# EAGLE design SaL_GPSTrack (EAGLE 8.3.1)
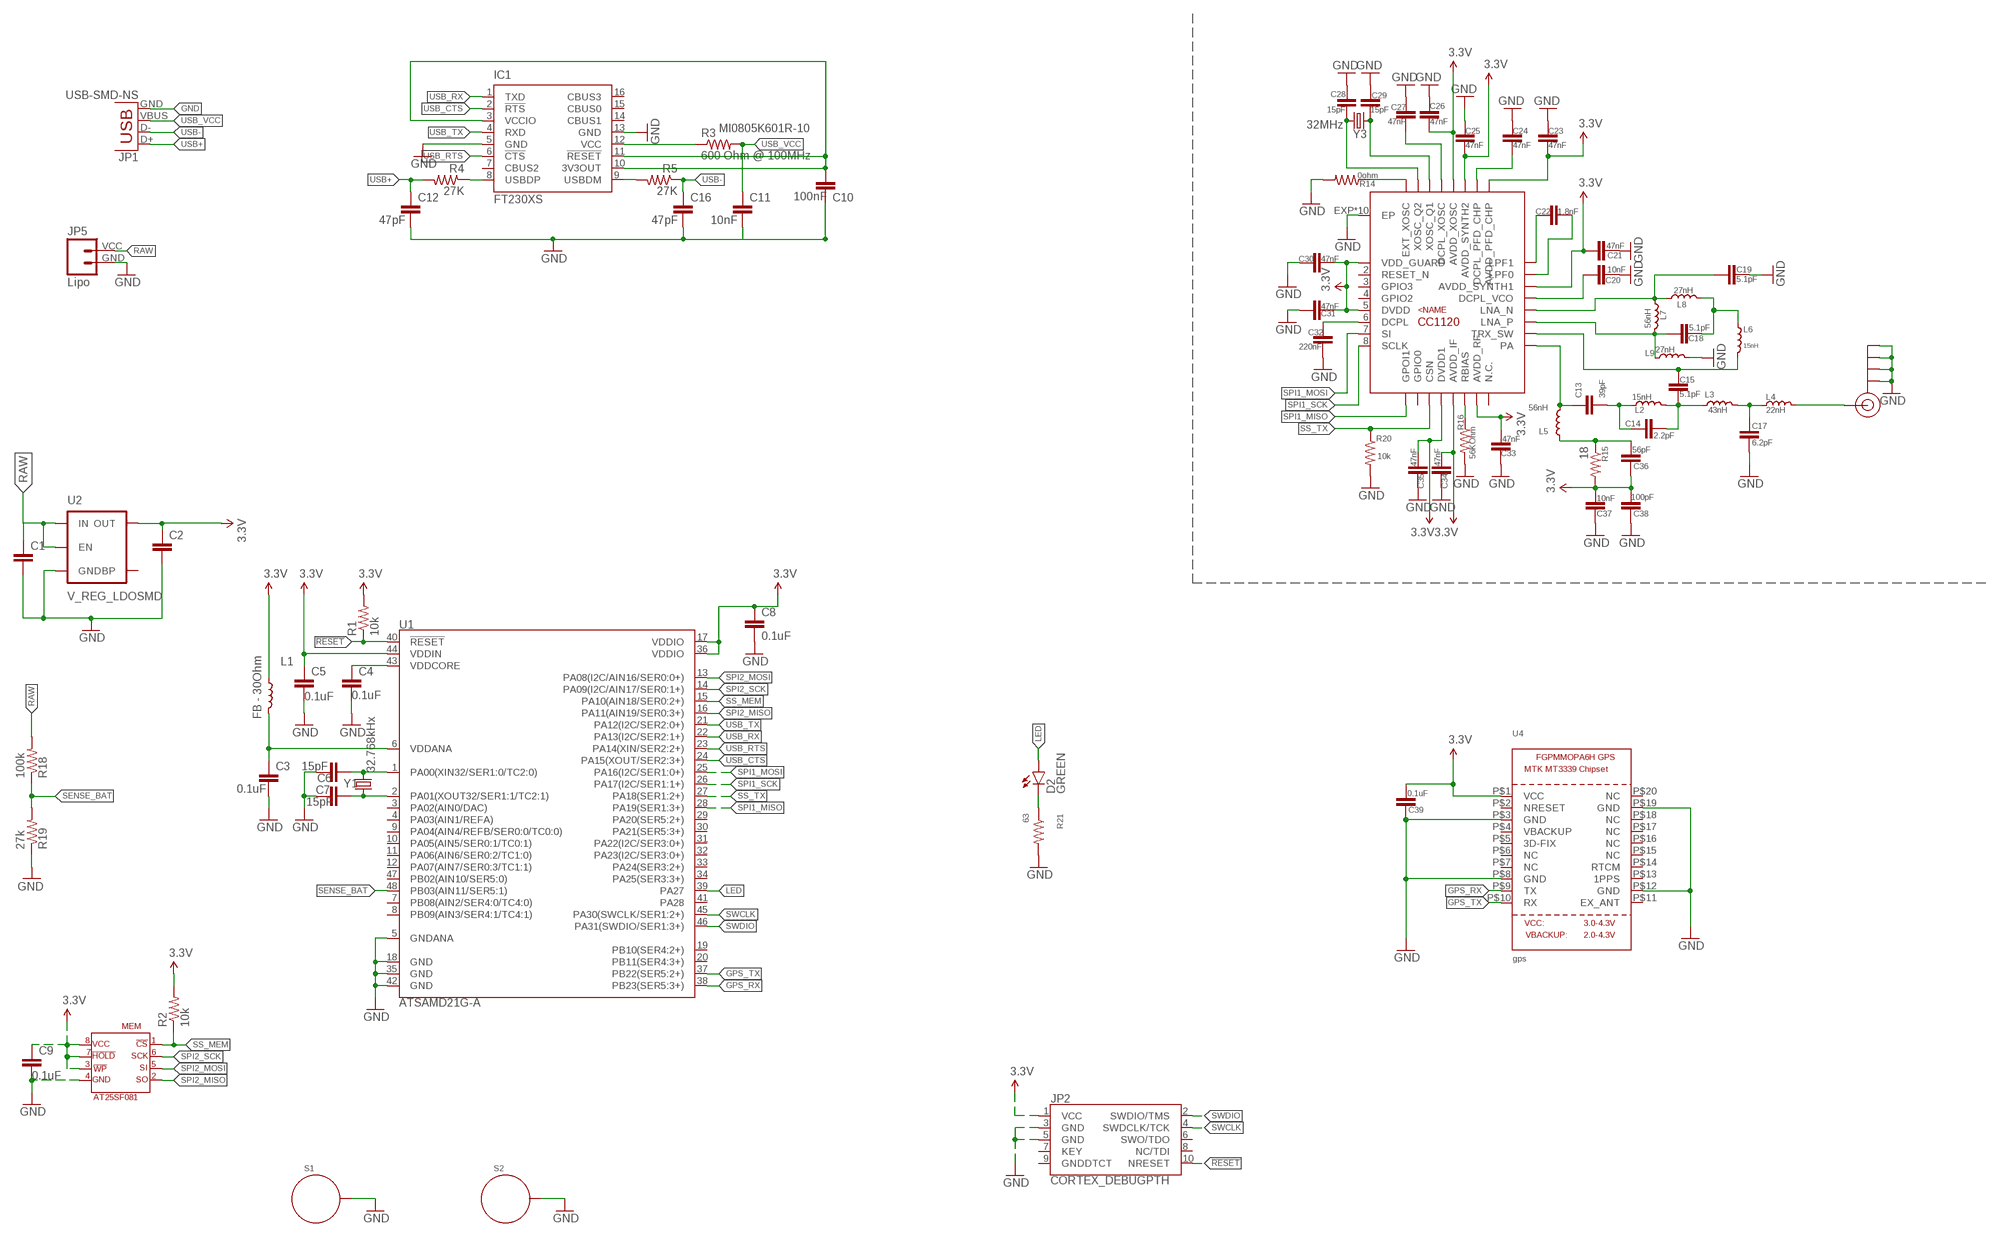
[diagram p0: schematic, sheet 1]

## Parts
C1  CAP0603-CAP  [0603-CAP]
C2  CAP0603-CAP  [0603-CAP]
C3  0.1uF  CAP0402-CAP  [0402-CAP]
C4  0.1uF  CAP0402-CAP  [0402-CAP]
C5  0.1uF  CAP0402-CAP  [0402-CAP]
C6  15pF  CAP0402-CAP  [0402-CAP]
C7  15pF  CAP0402-CAP  [0402-CAP]
C8  0.1uF  CAP0402-CAP  [0402-CAP]
C9  0.1uF  CAP0402-CAP  [0402-CAP]
C10  100nF  CAP0402-CAP  [0402-CAP]
C11  10nF  CAP0402-CAP  [0402-CAP]
C12  47pF  CAP0402-CAP  [0402-CAP]
C13  39pF  CAP0402-CAP  [0402-CAP]
C14  2.2pF  CAP0402-CAP  [0402-CAP]
C15  5.1pF  CAP0402-CAP  [0402-CAP]
C16  47pF  CAP0402-CAP  [0402-CAP]
C17  6.2pF  CAP0402-CAP  [0402-CAP]
C18  5.1pF  CAP0402-CAP  [0402-CAP]
C19  5.1pF  CAP0402-CAP  [0402-CAP]
C20  10nF  CAP0402-CAP  [0402-CAP]
C21  47nF  CAP0402-CAP  [0402-CAP]
C22  1.8nF  CAP0402-CAP  [0402-CAP]
C23  47nF  CAP0402-CAP  [0402-CAP]
C24  47nF  CAP0402-CAP  [0402-CAP]
C25  47nF  CAP0402-CAP  [0402-CAP]
C26  47nF  CAP0402-CAP  [0402-CAP]
C27  47nF  CAP0402-CAP  [0402-CAP]
C28  15pF  CAP0402-CAP  [0402-CAP]
C29  15pF  CAP0402-CAP  [0402-CAP]
C30  47nF  CAP0402-CAP  [0402-CAP]
C31  47nF  CAP0402-CAP  [0402-CAP]
C32  220nF  CAP0402-CAP  [0402-CAP]
C33  47nF  CAP0402-CAP  [0402-CAP]
C34  47nF  CAP0402-CAP  [0402-CAP]
C35  47nF  CAP0402-CAP  [0402-CAP]
C36  56pF  CAP0402-CAP  [0402-CAP]
C37  10nF  CAP0402-CAP  [0402-CAP]
C38  100pF  CAP0402-CAP  [0402-CAP]
C39  0.1uF  CAP0402-CAP  [0402-CAP]
D2  GREEN  LED-GREEN1206  [LED-1206]
IC1  FT230XS  [SSOP16]
J$1  SMA_EDGE  [SMA-EDGE]
JP1  USB-SMD-NS  [USB-MINIB-NOSTOP]
JP2  CORTEX_DEBUGPTH  [2X5-PTH-1.27MM]
JP5  Lipo  M024UCON-15767  [JST-2-SMD-VERT]
L1  FB - 30Ohm  INDUCTOR0603  [0603]
L2  15nH  INDUCTOR0402  [C0402]
L3  43nH  INDUCTOR0402  [C0402]
L4  22nH  INDUCTOR0402  [C0402]
L5  56nH  INDUCTOR0402  [C0402]
L6  15nH  INDUCTOR0402  [C0402]
L7  56nH  INDUCTOR0402  [C0402]
L8  27nH  INDUCTOR0402  [C0402]
L9  27nH  INDUCTOR0402  [C0402]
MEM  AT25SF081  [AT25SF081]
R1  10k  RESISTOR0402-RES  [0402-RES]
R2  10k  RESISTOR0402-RES  [0402-RES]
R3  600 Ohm @ 100MHz  RESISTOR0603-RES  [0603-RES]
R4  27K  RESISTOR0402-RES  [0402-RES]
R5  27K  RESISTOR0402-RES  [0402-RES]
R14  0ohm  RESISTOR0402-RES  [0402-RES]
R15  18  RESISTOR0402-RES  [0402-RES]
R16  56KOhm  RESISTOR0402-RES  [0402-RES]
R18  100k  RESISTOR0402-RES  [0402-RES]
R19  27k  RESISTOR0402-RES  [0402-RES]
R20  10k  RESISTOR0402-RES  [0402-RES]
R21  63  RESISTOR0402  [0402-RES]
S1  STANDOFF_ELECTRICAL  [STANDOFF-ELECTRICAL]
S2  STANDOFF_ELECTRICAL  [STANDOFF-ELECTRICAL]
TX/RX  CC1120  [CC1120]
U1  ATSAMD21G-A  [TQFP-48]
U2  V_REG_LDOSMD  [SOT23-5]
U4  gps  GPS_FGPMMOPA6H  [FGPMMOPA6H]
Y1  32.768kHx  CRYSTAL3.2X1.5MM  [CRYSTAL-SMD-3.2X1.5MM]
Y3  32MHz  CRYSTAL5X3  [CRYSTAL-SMD-5X3]

## Nets
!RESET: JP2.10(NRESET) R1.1 U1.40(!RESET!)
+3.3V: C2.1 C5.1 C8.1 C9.1 C21.1 C23.2 C25.2 C26.2 C30.2 C31.2 C33.2 C34.2 C35.2 C36.1 C37.2 C38.2 C39.2 JP2.1(VCC) L1.1 MEM.!HOLD MEM.!WP MEM.VCC R1.2 R2.2 R15.2 TX/RX.1(VDD_GUARD) TX/RX.5(DVDD) TX/RX.12(DVDD1) TX/RX.13(AVDD_IF) TX/RX.15(AVDD_RF) TX/RX.22(AVDD_SYNTH1) TX/RX.25(AVDD_PFD_CHP) TX/RX.27(AVDD_SYNTH2) TX/RX.28(AVDD_XOSC) U1.17(VDDIO) U1.36(VDDIO) U1.44(VDDIN) U2.5(OUT) U4.P$1(VCC) ; supply symbol labelled 3.3V
GND: C1.2 C2.2 C3.2 C4.2 C5.2 C6.2 C7.2 C8.2 C9.2 C10.2 C11.2 C12.2 C16.2 C17.2 C19.2 C20.2 C21.2 C23.1 C24.1 C25.1 C26.1 C27.1 C28.1 C29.1 C30.1 C31.1 C32.1 C33.1 C34.1 C35.1 C37.1 C38.1 C39.1 IC1.5(GND) IC1.13(GND) J$1.GND@0(GND) J$1.GND@1(GND) J$1.GND@2(GND) J$1.GND@3(GND) JP1.GND JP2.3(GND) JP2.5(GND) JP5.GND L9.2 MEM.GND R14.2 R16.2 R19.1 R20.2 R21.2 S1.P1 S2.P1 TX/RX.EXP(EP) TX/RX.EXP@1(EP) TX/RX.EXP@2(EP) TX/RX.EXP@3(EP) TX/RX.EXP@4(EP) TX/RX.EXP@5(EP) TX/RX.EXP@6(EP) TX/RX.EXP@7(EP) TX/RX.EXP@8(EP) TX/RX.EXP@9(EP) U1.5(GNDANA) U1.18(GND) U1.35(GND) U1.42(GND) U2.2(GND) U4.P$3(GND) U4.P$8(GND) U4.P$12(GND) U4.P$19(GND)
GPS_RX: U1.38(PB23(SER5:3+)) U4.P$9(TX)
GPS_TX: U1.37(PB22(SER5:2+)) U4.P$10(RX)
LED: D2.A U1.39(PA27)
N$1: IC1.12(VCC) R3.1
N$3: C6.1 U1.1(PA00(XIN32/SER1:0/TC2:0)) Y1.P$2
N$4: C7.1 U1.2(PA01(XOUT32/SER1:1/TC2:1)) Y1.P$1
N$5: C3.1 L1.2 U1.6(VDDANA)
N$6: C4.1 U1.43(VDDCORE)
N$7: C10.1 IC1.3(VCCIO) IC1.10(3V3OUT) IC1.11(!RESET)
N$8: IC1.8(USBDP) R4.1
N$9: C13.1 L5.2 TX/RX.17(PA)
N$10: C13.2 C14.1 L2.1
N$11: C14.2 C15.1 L2.2 L3.1
N$12: C17.1 L3.2 L4.1
N$13: J$1.SIG(SIGNAL) L4.2
N$14: IC1.9(USBDM) R5.2
N$16: C15.2 L6.2 TX/RX.18(TRX_SW)
N$17: C18.1 L7.2 L9.1 TX/RX.19(LNA_P)
N$18: C18.2 L6.1 L8.2
N$19: C19.1 L7.1 L8.1 TX/RX.20(LNA_N)
N$20: C22.1 TX/RX.24(LPF1)
N$21: C22.2 TX/RX.23(LPF0)
N$22: C20.1 TX/RX.21(DCPL_VCO)
N$23: C24.2 TX/RX.26(DCPL_PFD_CHP)
N$24: R16.1 TX/RX.14(RBIAS)
N$25: R14.1 TX/RX.32(EXT_XOSC)
N$26: C27.2 TX/RX.29(DCPL_XOSC)
N$27: C29.2 TX/RX.30(XOSC_Q1) Y3.3
N$28: C28.2 TX/RX.31(XOSC_Q2) Y3.1
N$29: D2.C R21.1
N$34: C32.2 TX/RX.6(DCPL)
N$38: C36.2 L5.1 R15.1
RAW: C1.1 JP5.VCC R18.2 U2.1(IN) U2.3(EN)
SENSE_BAT: R18.1 R19.2 U1.48(PB03(AIN11/SER5:1))
SPI1_MISO: TX/RX.9(GPOI1) U1.28(PA19(SER1:3+))
SPI1_MOSI: TX/RX.7(SI) U1.25(PA16(I2C/SER1:0+))
SPI1_SCK: TX/RX.8(SCLK) U1.26(PA17(I2C/SER1:1+))
SPI2_MISO: MEM.SO U1.16(PA11(AIN19/SER0:3+))
SPI2_MOSI: MEM.SI U1.13(PA08(I2C/AIN16/SER0:0+))
SPI2_SCK: MEM.SCK U1.14(PA09(I2C/AIN17/SER0:1+))
SS_MEM: MEM.!CS R2.1 U1.15(PA10(AIN18/SER0:2+))
SS_TX: R20.1 TX/RX.11(CSN) U1.27(PA18(SER1:2+))
SWCLK: JP2.4(SWDCLK/TCK) U1.45(PA30(SWCLK/SER1:2+))
SWDIO: JP2.2(SWDIO/TMS) U1.46(PA31(SWDIO/SER1:3+))
USB+: C12.1 JP1.D+ R4.2
USB-: C16.1 JP1.D- R5.1
USB_CTS: IC1.2(!RTS) U1.24(PA15(XOUT/SER2:3+))
USB_RTS: IC1.6(!CTS) U1.23(PA14(XIN/SER2:2+))
USB_RX: IC1.1(TXD) U1.22(PA13(I2C/SER2:1+))
USB_TX: IC1.4(RXD) U1.21(PA12(I2C/SER2:0+))
USB_VCC: C11.1 JP1.VBUS R3.2
Unconnected: IC1.7(CBUS2) IC1.14(CBUS1) IC1.15(CBUS0) IC1.16(CBUS3) JP2.6(SWO/TDO) JP2.7(KEY) JP2.8(NC/TDI) JP2.9(GNDDTCT) TX/RX.2(RESET_N) TX/RX.3(GPIO3) TX/RX.4(GPIO2) TX/RX.10(GPIO0) TX/RX.16(N.C.) U1.3(PA02(AIN0/DAC)) U1.4(PA03(AIN1/REFA)) U1.7(PB08(AIN2/SER4:0/TC4:0)) U1.8(PB09(AIN3/SER4:1/TC4:1)) U1.9(PA04(AIN4/REFB/SER0:0/TC0:0)) U1.10(PA05(AIN5/SER0:1/TC0:1)) U1.11(PA06(AIN6/SER0:2/TC1:0)) U1.12(PA07(AIN7/SER0:3/TC1:1)) U1.19(PB10(SER4:2+)) U1.20(PB11(SER4:3+)) U1.29(PA20(SER5:2+)) U1.30(PA21(SER5:3+)) U1.31(PA22(I2C/SER3:0+)) U1.32(PA23(I2C/SER3:0+)) U1.33(PA24(SER3:2+)) U1.34(PA25(SER3:3+)) U1.41(PA28) U1.47(PB02(AIN10/SER5:0)) U2.4(BP) U4.P$2(NRESET) U4.P$4(VBACKUP) U4.P$5(3D-FIX) U4.P$6(NC) U4.P$7(NC) U4.P$11(EX_ANT) U4.P$13(1PPS) U4.P$14(RTCM) U4.P$15(NC) U4.P$16(NC) U4.P$17(NC) U4.P$18(NC) U4.P$20(NC)

## Library data of the parts
C1 C2 C13-C15 C17-C39 = SparkFun-Capacitors:CAP: Capacitor Standard 0603 ceramic capacitor, and 0.1" leaded capacitor.
C3-C12 C16 = SparkFun-Passives:CAP: Capacitor Standard 0603 ceramic capacitor, and 0.1" leaded capacitor.
D2 = SparkFun-LED:LED-GREEN: Various green LEDs Green LEDs used in SFE Production 0603- DIO-00821 LARGE- DIO-00862 LILYPAD- DIO-09910; PROD_ID: DIO-00862
IC1 = ftdichip:FT230X: USB to BASIC UART IC Auto generated by make-symbol-device-package-bsdl.ulp Rev. 43 Source: Data sheet <http://www.ftdichip.com/Support/Documents/DataSheets/ICs/DS_FT230X.pdf>
J$1 = SparkFun-Connectors:SMA_EDGE: SMA Antenna Connector End launch SMA connector. The paste layer has been removed so that the connector can be hand soldered onto the board after reflow.
JP1 = SparkFun-Connectors:USB: USB Connectors USB-B-PTH is fully proven SKU : PRT-00139/CONN-08278 USB-miniB is fully proven SKU : PRT-00587 USB-A-PCB is untested. USB-A-H is throughly reviewed, but untested. Spark Fun Electronics SKU : PRT-00437 USB-B-SMT is throughly reviewed, but untested. Needs silkscreen touching up. USB-A-S has not been used/tested USB-MB-H has not been used/tested USB-MICROB has been used. CONN-09505
JP2 = SparkFun-Connectors:CORTEX_DEBUG: Cortex Debug Connector Datasheet <http://infocenter.arm.com/help/topic/com.arm.doc.faqs/attached/13634/cortex_debug_connectors.pdf>
JP5 = SparkFun-Connectors:M02: Standard 2-pin 0.1" header. Use with - straight break away headers ( PRT-00116) - right angle break away headers (PRT-00553) - swiss pins (PRT-00743) - machine pins (PRT-00117) - female headers (PRT-00115) Molex polarized connector foot print use with: PRT-08233 with associated crimp pins and housings. 2.54_SCREWTERM for use with PRT-10571. 3.5mm Screw Terminal footprints for PRT-08084 5mm Screw Terminal footprints for use with PRT-08432
L1-L9 = SparkFun-Passives:INDUCTOR: Inductors Basic Inductor/Choke - 0603 and 1206. Footprints are not proven and vary greatly between part numbers. INDUCTOR POWER 3.3UH 4.0A SMD 0.197" L x 0.197" W x 0.177" H (5.00mm x 5.00mm x 4.50mm)
MEM = SaL-lib:AT25SF081: AT25SF081 - 8M memory smd
R1 R2 R4 R5 R14-R16 R18-R20 = SparkFun-Passives:RESISTOR: Resistor Basic schematic elements and footprints for 0603, 1206, and PTH resistors.
R3 = SparkFun-Resistors:RESISTOR: Resistor Basic schematic elements and footprints for 0603, 1206, and PTH resistors.; MI0805K601R-10: MI0805K601R-10
R21 = SparkFun-Resistors:RESISTOR: Resistor Basic schematic elements and footprints for 0603, 1206, and PTH resistors.
S1 S2 = SparkFun-Electromechanical:STANDOFF_ELECTRICAL: A standoff intended to be an electrically connected point. Pad size and stop size allow for a #4 Phillips pan screw head to make a solid connection to the board.
TX/RX = SaL-lib:CC1120
U1 = SparkFun-DigitalIC:ATSAMD21G: Atmel SAMD21G SMART ARM-Based Microcontroller The Atmel ® | SMART ™ SAM D21 is a series of low-power microcontrollers using the 32-bit ARM ® Cortex ® -M0+ processor, and ranging from 32- to 64-pins with up to 256KB Flash and 32KB of SRAM. The SAM D21 devices operate at a maximum frequency of 48MHz and reach 2.46 CoreMark/MHz. They are designed for simple and intuitive migration with identical peripheral modules, hex compatible code, identical linear address map and pin compatible migration paths between all devices in the product series. All devices include intelligent and flexible peripherals, Atmel Event System for inter-peripheral signaling, and support for capacitive touch button, slider and wheel user interfaces.; PROD_ID: IC-13064
U2 = SparkFun-PowerIC:V_REG_LDO: Voltage Regulator LDO Standard 150mA LDO voltage regulator in SOT-23 layout. Micrel part MIC5205. BP (by-pass) pin is used to lower output noise with 470pF cap.
U4 = adafruit:GPS_FGPMMOPA6H: GPS Module - MTK MT3339 Chipset, -165dBm sensitivity, 22 channels, 10Hz, auto-select external antenna options
Y1 = SparkFun-FreqCtrl:CRYSTAL: Various standard crystals. Proven footprints.
Y3 = SparkFun-FreqCtrl:CRYSTAL: Various standard crystals. Proven footprints.; PROD_ID: XTAL-08218

## Board
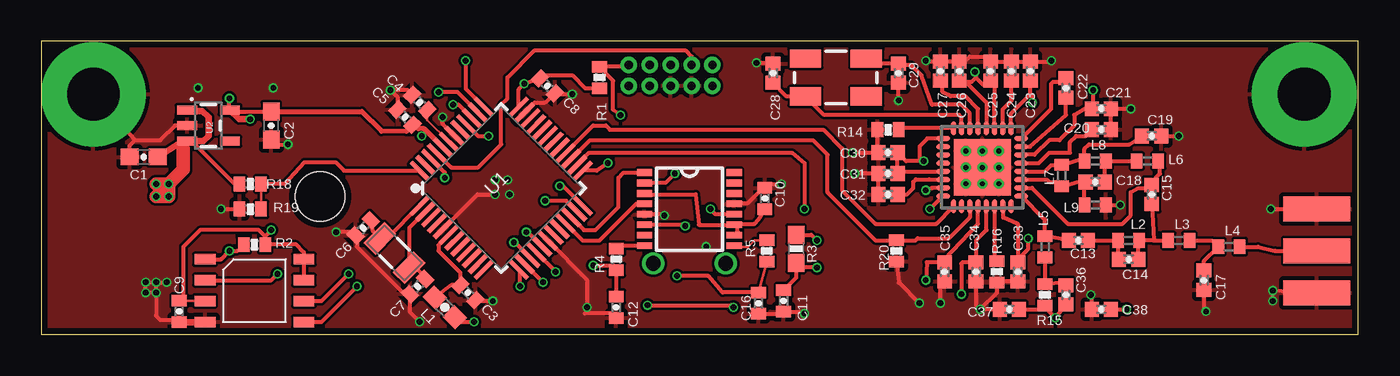
[diagram p1: board, top side]
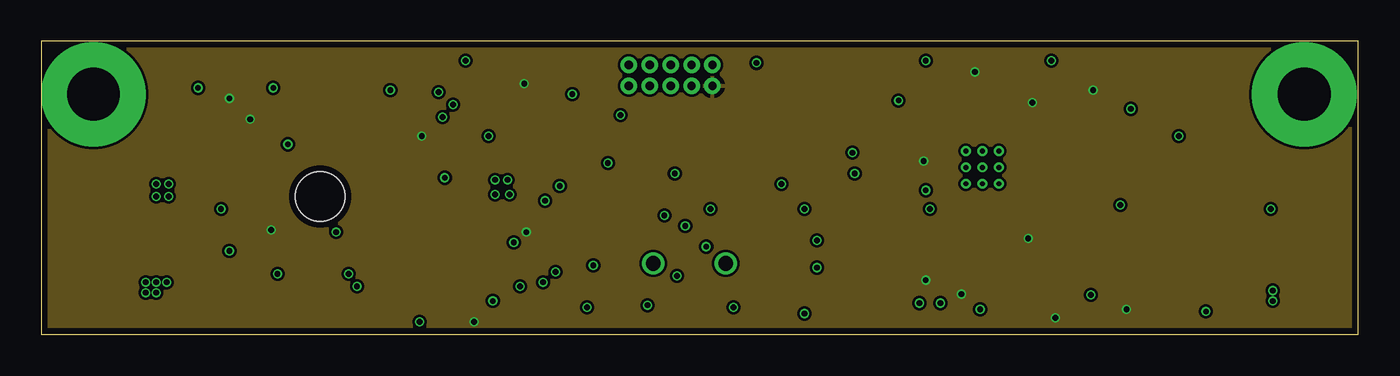
[diagram p2: board, inner layer Route2]
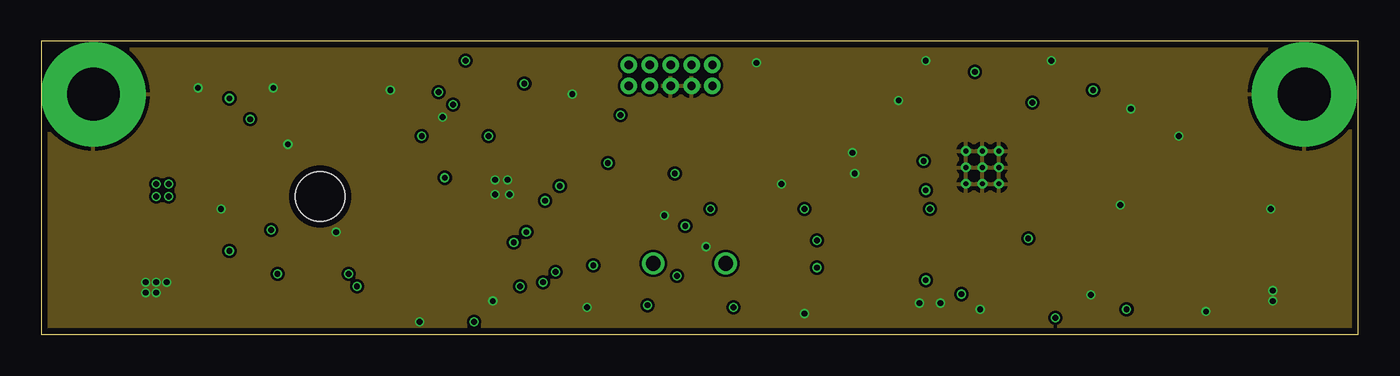
[diagram p3: board, inner layer Route15]
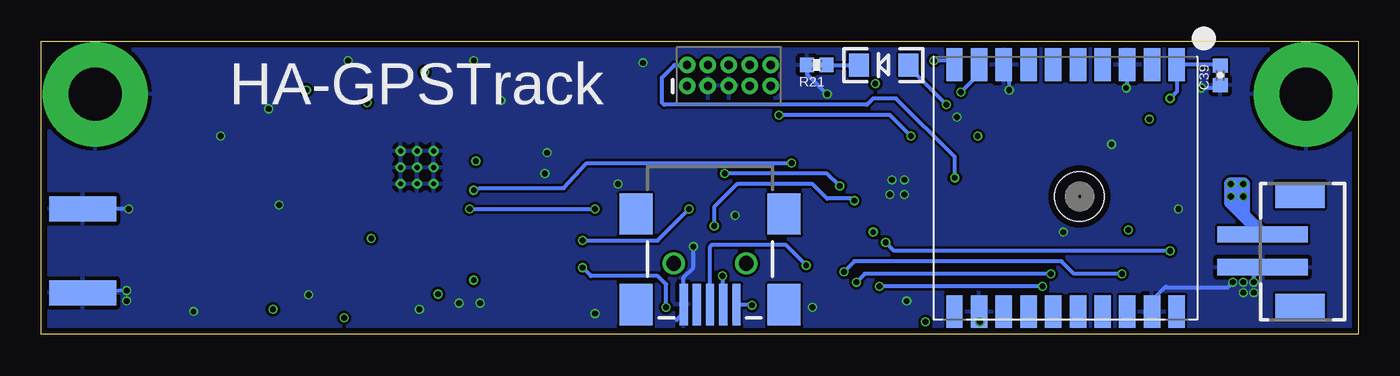
[diagram p4: board, bottom side, seen from below]

Size 79.99 x 17.83 mm. Coordinates in mm from the lower left corner, seen from the top.
Outline: 0,0 79.99,0 79.99,17.83 0,17.83 0,0
Copper layers (1*2*15*16): Top 0.035559375mm / dielectric 0.17018125mm / Route2 0.01778125mm / dielectric 47mil / Route15 0.01778125mm / dielectric 0.17018125mm / Bottom 0.035559375mm
Design rules "oshpark-4layer-tented *": minimum track width 5mil, minimum drill 10mil, track to track 6mil, track to pad 6mil, pad to pad 6mil, via to via 6mil, smd to smd 5mil, copper to edge 15mil, drill to drill 6mil, minimum pad ring 4mil, minimum via ring 4mil, stop-mask expansion 2.5mil, vias tented up to drill 20mil, thermal gap 10mil

### Footprints (pad centres in the part's own frame; a part is rotated, then mirrored left to right if it is on the bottom)
0603-CAP = smd 1.1 x 1: 1 -0.85,0; 2 0.85,0
0402-CAP = smd 0.7 x 0.9: 1 -0.65,0; 2 0.65,0
0402-CAP' = smd 0.85 x 0.9: 1 -0.58,0; 2 0.58,0
LED-1206 = smd 1.2 x 1.4: A -1.5,0; C 1.5,0
SSOP16 = smd 0.914 x 0.406: 1 -2.718,2.223; 2 -2.718,1.587; 3 -2.718,0.953; 4 -2.718,0.318; 5 -2.718,-0.318; 6 -2.718,-0.953; 7 -2.718,-1.587; 8 -2.718,-2.223; 9 2.718,-2.223; 10 2.718,-1.587; 11 2.718,-0.953; 12 2.718,-0.318; 13 2.718,0.318; 14 2.718,0.953; 15 2.718,1.587; 16 2.718,2.223
SMA-EDGE = smd 1.524 x 4.064: GND@0 0,0; GND@1 5.08,0; SIG 2.54,0 | smd 1.524 x 4.064 bottom: GND@2 0,0; GND@3 5.08,0
USB-MINIB-NOSTOP = smd 2.5 x 0.5: D+ 2.5,0; D- 2.5,0.8; GND 2.5,-1.6; ID 2.5,-0.8; VBUS 2.5,1.6 | smd 2.5 x 2: G1 -3,-4.5; G2 -3,4.5; G3 2.5,4.5; G4 2.5,-4.5 | drill 0.9 pad 0.8: H1 0,2.2 | drill 0.9 pad 0.787: H2 0,-2.2
2X5-PTH-1.27MM = drill 0.508 pad 1: 1 -2.54,-0.635; 2 -2.54,0.635; 3 -1.27,-0.635; 4 -1.27,0.635; 5 0,-0.635; 6 0,0.635; 7 1.27,-0.635; 8 1.27,0.635; 9 2.54,-0.635; 10 2.54,0.635
JST-2-SMD-VERT = smd 1 x 5.5: GND 1,-2; VCC -1,-2 | smd 1.6 x 3: P$1 -3.4,0.27; P$2 3.4,0.27
0603 = smd 1.1 x 1: 1 -0.85,0; 2 0.85,0
C0402 = smd 0.7 x 0.9: 1 -0.65,0; 2 0.65,0
AT25SF081 = smd 1.27 x 0.635: !CS -3,2.54; !HOLD 3,1.27; !WP -3,0; GND -3,-1.27; SCK 3,0; SI 3,-1.27; SO -3,1.27; VCC 3,2.54
0402-RES = smd 0.7 x 0.9: 1 -0.65,0; 2 0.65,0
0603-RES = smd 1.1 x 1: 1 -0.85,0; 2 0.85,0
0402-RES' = smd 0.85 x 0.9: 1 -0.58,0; 2 0.58,0
STANDOFF-ELECTRICAL = drill 3.2 pad 6.35: P1 0,0
CC1120 = smd 0.85 x 0.3: 1 -2.375,1.75; 2 -2.375,1.25; 3 -2.375,0.75; 4 -2.375,0.25; 5 -2.375,-0.25; 6 -2.375,-0.75; 7 -2.375,-1.25; 8 -2.375,-1.75; 17 2.375,-1.75; 18 2.375,-1.25; 19 2.375,-0.75; 20 2.375,-0.25; 21 2.375,0.25; 22 2.375,0.75; 23 2.375,1.25; 24 2.375,1.75 | smd 0.3 x 0.85: 9 -1.75,-2.375; 10 -1.25,-2.375; 11 -0.75,-2.375; 12 -0.25,-2.375; 13 0.25,-2.375; 14 0.75,-2.375; 15 1.25,-2.375; 16 1.75,-2.375; 25 1.75,2.375; 26 1.25,2.375; 27 0.75,2.375; 28 0.25,2.375; 29 -0.25,2.375; 30 -0.75,2.375; 31 -1.25,2.375; 32 -1.75,2.375 | smd 3.45 x 3.45: EXP 0,0 | drill 0.3 pad 0.6: EXP@1 -1,1; EXP@2 0,1; EXP@3 1,1; EXP@4 -1,0; EXP@5 0,0; EXP@6 1,0; EXP@7 -1,-1; EXP@8 0,-1; EXP@9 1,-1
TQFP-48 = smd 1.5 x 0.28: 1 -4.25,2.75; 2 -4.25,2.25; 3 -4.25,1.75; 4 -4.25,1.25; 5 -4.25,0.75; 6 -4.25,0.25; 7 -4.25,-0.25; 8 -4.25,-0.75; 9 -4.25,-1.25; 10 -4.25,-1.75; 11 -4.25,-2.25; 12 -4.25,-2.75; 25 4.25,-2.75; 26 4.25,-2.25; 27 4.25,-1.75; 28 4.25,-1.25; 29 4.25,-0.75; 30 4.25,-0.25; 31 4.25,0.25; 32 4.25,0.75; 33 4.25,1.25; 34 4.25,1.75; 35 4.25,2.25; 36 4.25,2.75 | smd 0.28 x 1.5: 13 -2.75,-4.25; 14 -2.25,-4.25; 15 -1.75,-4.25; 16 -1.25,-4.25; 17 -0.75,-4.25; 18 -0.25,-4.25; 19 0.25,-4.25; 20 0.75,-4.25; 21 1.25,-4.25; 22 1.75,-4.25; 23 2.25,-4.25; 24 2.75,-4.25; 37 2.75,4.25; 38 2.25,4.25; 39 1.75,4.25; 40 1.25,4.25; 41 0.75,4.25; 42 0.25,4.25; 43 -0.25,4.25; 44 -0.75,4.25; 45 -1.25,4.25; 46 -1.75,4.25; 47 -2.25,4.25; 48 -2.75,4.25
SOT23-5 = smd 0.55 x 1.2: 1 -0.95,-1.3; 2 0,-1.3; 3 0.95,-1.3; 4 0.95,1.3; 5 -0.95,1.3
FGPMMOPA6H = smd 2 x 1: P$1 -7.5,6.75; P$2 -7.5,5.25; P$3 -7.5,3.75; P$4 -7.5,2.25; P$5 -7.5,0.75; P$6 -7.5,-0.75; P$7 -7.5,-2.25; P$8 -7.5,-3.75; P$9 -7.5,-5.25; P$10 -7.5,-6.75; P$11 7.5,-6.75; P$12 7.5,-5.25; P$13 7.5,-3.75; P$14 7.5,-2.25; P$15 7.5,-0.75; P$16 7.5,0.75; P$17 7.5,2.25; P$18 7.5,3.75; P$19 7.5,5.25; P$20 7.5,6.75 | hole 3: 0.5,0.85
CRYSTAL-SMD-3.2X1.5MM = smd 1 x 1.8: P$1 -1.25,0; P$2 1.25,0
CRYSTAL-SMD-5X3 = smd 1.9 x 1.1: 1 -1.85,-1.15; 2 1.85,-1.15; 3 1.85,1.15; 4 -1.85,1.15

### Placement (x,y rotation side)
C1  6.22,10.79 180 top
C2  13.97,12.7 270 top
C3  25.91,2.54 315 top
C4  22.99,14.1 135 top
C5  22.1,13.21 135 top
C6  19.56,6.48 225 top
C7  22.86,2.92 225 top
C8  30.73,15.11 315 top
C9  8.38,1.4 270 top
C10  43.94,8.25 90 top
C11  45.09,2.03 270 top
C12  34.93,1.65 270 top
C13  39pF  [0402-CAP']  62.99,5.71 0 top
C14  2.2pF  [0402-CAP']  66.04,4.57 0 top
C15  5.1pF  [0402-CAP']  67.44,8.51 90 top
C16  43.56,1.91 270 top
C17  6.2pF  [0402-CAP']  70.61,3.3 270 top
C18  5.1pF  [0402-CAP']  64.01,9.27 0 top
C19  5.1pF  [0402-CAP']  67.44,12.06 0 top
C20  10nF  [0402-CAP']  64.39,12.45 0 top
C21  47nF  [0402-CAP']  64.39,13.72 0 top
C22  1.8nF  [0402-CAP']  62.23,14.99 270 top
C23  47nF  [0402-CAP']  60.07,16 270 top
C24  47nF  [0402-CAP']  58.93,16 270 top
C25  47nF  [0402-CAP']  57.66,16 270 top
C26  47nF  [0402-CAP']  55.75,16 270 top
C27  47nF  [0402-CAP']  54.61,16 270 top
C28  15pF  [0402-CAP']  44.45,15.88 270 top
C29  15pF  [0402-CAP']  52.07,15.88 90 top
C30  47nF  [0402-CAP']  51.43,11.05 0 top
C31  47nF  [0402-CAP']  51.43,9.78 0 top
C32  220nF  [0402-CAP']  51.43,8.51 0 top
C33  47nF  [0402-CAP']  59.31,3.81 90 top
C34  47nF  [0402-CAP']  56.77,3.81 90 top
C35  47nF  [0402-CAP']  54.86,3.81 90 top
C36  56pF  [0402-CAP']  62.23,2.41 90 top
C37  10nF  [0402-CAP']  58.8,1.52 0 top
C38  100pF  [0402-CAP']  64.39,1.52 0 top
C39  0.1uF  [0402-CAP']  8.38,15.75 90 bottom
D2  28.83,16.38 180 bottom
IC1  39.37,7.62 0 top
J$1  77.47,2.54 90 top
JP1  39.37,4.32 270 bottom
JP2  38.23,15.75 0 bottom
JP5  3.81,5.08 270 bottom
L1  24.51,1.65 135 top
L2  66.04,5.71 0 top
L3  69.09,5.71 0 top
L4  72.14,5.33 0 top
L5  60.96,5.33 90 top
L6  67.18,10.54 0 top
L7  61.98,9.65 270 top
L8  64.01,10.54 0 top
L9  64.01,7.87 0 top
MEM  12.95,2.03 0 top
R1  33.91,15.62 270 top
R2  12.95,5.46 0 top
R3  45.85,5.21 270 top
R4  34.93,4.57 270 top
R5  44.07,5.08 90 top
R14  51.43,12.45 180 top
R15  60.96,2.41 270 top
R16  58.04,3.81 270 top
R18  12.7,9.14 180 top
R19  12.7,7.62 0 top
R20  51.94,5.08 270 top
R21  63  [0402-RES']  32.89,16.38 180 bottom
S1  76.71,14.6 0 top
S2  3.18,14.6 0 top
TX/RX  57.15,10.16 0 top
U1  27.94,8.89 45 top
U2  10.16,12.7 270 top
U4  17.78,8.89 270 bottom
Y1  21.46,4.95 135 top
Y3  48.26,15.62 0 top

### Tracks (layer width: path | path; a pad name or v marks a point on that pad's centre or on a via)
!RESET  (via drill 0.35)
  Top 0.254: U1.40 26.53,12.06 v27.18,12.06 | v35.18,13.34 34.74,13.65 34.74,15.43 34.04,16.13 R1.1 35.58,16.27 JP2.10
  Bottom 0.254: v27.18,12.06 28.45,13.34 v35.18,13.34
+3.3V  (via drill 0.35)
  Top 0.152: 22.66,12.75 C5.1 | C9.1 8.4,2.03 MEM.!WP
  Top 0.254: v11.43,14.35 11.43,13.68 U2.5 11.56,13.55 C2.1 | 13.6,5.95 R2.2 15.49,5.46 15.95,5 MEM.VCC MEM.!HOLD | 13.6,5.95 13.21,6.35 9.65,6.35 8.64,5.33 8.64,2.27 8.4,2.03 | v13.97,6.35 13.97,6.32 13.6,5.95 | U1.36 29,14.9 v29.34,15.24 C8.1 30.45,15.75 32.26,15.75 33.04,14.97 R1.2 | TX/RX.5 52.15,9.91 C31.2 C30.2 52.52,10.54 53.42,10.54 | 53.42,10.54 v53.59,10.54 | TX/RX.1 53.82,11.91 53.34,11.43 53.34,10.62 53.42,10.54 | TX/RX.15 58.42,7.77 58.42,7.11 59.31,6.73 C33.2 59.31,4.57 59.94,5.21 v59.94,5.84 | TX/RX.13 57.4,6.35 56.77,5.71 C34.2 55.95,4.39 55.88,4.32 v55.88,2.45 55.88,2.41 | TX/RX.12 56.9,6.73 54.86,4.57 C35.2 53.78,4.39 v53.72,3.3 | 60.96,1.69 R15.2 | 60.96,1.69 60.96,1.65 61.56,1.05 | 61.56,1.05 v61.6,1.02 | C36.1 62.23,1.73 61.56,1.05 | C38.2 v65.91,1.52 | TX/RX.28 57.4,14.1 56.08,15.42 C26.2 55.82,15.42 55.88,15.37 | TX/RX.27 57.9,14.47 57.91,14.48 57.91,15.17 | 57.91,15.17 C25.2 | 57.91,15.17 57.22,15.17 56.77,15.62 | 56.77,15.62 56.77,15.9 | 56.77,15.9 v56.71,15.96 | 56.77,16 56.77,15.9 | 56.77,15.62 56.52,15.37 55.88,15.37 | 55.88,15.37 55.75,15.37 | C37.2 60.8,1.52 60.96,1.69 | U1.17 29.55,6.22 v29.46,6.22 | L1.1 25.15,0.76 v26.29,0.76 | TX/RX.25 58.9,13.43 60.07,14.6 | 60.07,14.6 C23.2 | TX/RX.22 59.54,10.92 60.32,10.92 61.21,11.81 61.85,11.81 62.74,12.7 62.74,13.34 63.37,13.72 C21.1 63.88,13.79 v63.88,14.86 | v60.2,14.1 60.2,14.48 60.07,14.6
  Top 0.305: C2.1 19.47,13.55 20.67,12.35 22.18,12.34 C5.1 | U1.44 23.27,12.5 22.9,12.5 22.66,12.75
  Top 0.406: U2.5 12.03,13.08 v12.7,13.08
  Bottom 0.254: v11.43,14.35 11.03,14.75 U4.P$1 8.32,16.39 C39.2
  other vias: 23.11,12.06
  pour Route2: -1.27,21.59 81.28,21.59 81.28,-1.27 -1.27,-1.27
GND  (via drill 0.35)
  Top 0.254: 6.98,2.47 v6.98,2.54 v6.98,3.17 | 6.98,2.47 6.98,1.14 7.24,0.89 8.24,0.89 C9.2 | 6.98,2.47 6.92,2.54 v6.35,2.54 v6.35,3.17 v6.98,3.17 | v6.98,3.17 v7.62,3.17 | U1.35 29.97,14.1 30.61,14.1 30.69,14.14 C8.2 31.24,14.6 v32.26,14.6 | C17.2 70.61,1.52 v70.74,1.4 | v49.4,9.78 C31.1 C32.1 | v49.28,11.05 C30.1 50.79,11.12 R14.2 | v61.34,16.64 61.29,16.58 C23.1 C24.1 C25.1 57.35,16.89 56.39,16.89 56.08,16.58 C26.1 C27.1 53.78,16.58 v53.72,16.64 | v66.17,13.72 C21.2 C20.2 | C19.2 v69.09,12.06 | v74.8,2.03 v74.8,2.67 J$1.GND@0 | v74.68,7.62 J$1.GND@1 | L9.2 v65.53,7.87 | C38.1 63.81,2.36 v63.75,2.41 | C34.1 56.77,1.78 v57.02,1.52 | 58.04,3.05 R16.2 | 58.04,3.05 58.04,2.54 v57.02,1.52 | C33.1 58.22,3.23 58.04,3.05 | v54.61,1.91 54.61,2.98 C35.1 | R20.2 52.09,3.16 v53.34,1.91 | v43.43,16.51 44.4,16.51 C28.1 | C3.2 26.42,2.03 v27.43,2.03 | C2.2 14.26,11.56 v14.99,11.56 | v10.92,7.62 R19.1 | v17.91,6.22 19.02,6.22 C6.2 19.18,5.97 19.18,5.33 21.92,2.59 C7.2 22.4,1.35 v22.99,0.76 | C12.2 34.66,1.27 33.02,1.27 33.15,1.4 v33.15,1.65 33.15,3.33 U1.18 | v44.96,9.14 43.8,9.14 C10.2 43.83,8.91 42.93,8 42.15,8 IC1.13 | v37.85,7.24 37.91,7.3 IC1.5 | C16.2 44.96,1.25 C11.2 46.24,1.38 v46.35,1.27 | U1.42 24.38,12.8 v24.38,13.21 | U1.5 26.5,8.51 v27.56,8.51 | C5.2 21.64,14.43 v21.21,14.86 22.23,14.86 C4.2 | v52.07,14.22 C29.1 | C37.1 v57.02,1.52 | C1.2 5.37,11.47 5.71,11.81 | 5.71,11.81 7.24,11.81 8.13,12.7 U2.2 | 5.71,11.81 S2.P1
  Top 0.406: MEM.GND 9.94,0.75 C9.2
  Bottom 0.254: v6.35,3.17 6.35,3.54 JP5.GND | U4.P$19 12.53,2.07 11.75,2.86 | 11.75,2.86 11.68,2.92 | 11.75,2.86 7.94,2.86 v7.62,3.17 | v74.68,7.62 J$1.GND@1 | v74.8,2.67 J$1.GND@0 | C39.1 8.33,14.99 v9.52,14.99 | v14.1,14.99 14.03,15.05 U4.P$3 | 41.4,0.89 40.97,1.32 JP1.GND 40.97,3.48 40.39,4.06 40.39,5.21 v40.39,5.33 | U4.P$8 21.21,16.07 v21.21,14.86 | U4.P$12 22.99,1.35 v22.99,0.76 | R21.2 33.47,15.82 v32.26,14.6
  other vias: 27.56,9.4 28.32,9.4 28.45,8.51
  pour Route15: -1.27,20.32 81.28,20.32 81.28,-1.27 -1.27,-1.27
  pour Bottom: -1.27,21.59 -1.27,-2.54 82.55,-2.54 82.55,21.59
  pour Top: -1.27,20.32 -1.27,-2.54 82.55,-2.54 82.55,20.32
GPS_RX  (via drill 0.35)
  Top 0.254: U1.38 25.28,14.73 v24.13,14.73
  Bottom 0.254: v24.13,14.73 23.03,15.83 U4.P$9
GPS_TX  (via drill 0.35)
  Top 0.254: v25.78,16.64 25.78,14.94 U1.37
  Bottom 0.254: U4.P$10 24.78,16.64 v25.78,16.64
LED  (via drill 0.35)
  Top 0.254: U1.39 25.34,13.97 v25.02,13.97
  Bottom 0.254: v25.02,13.97 27.33,16.28 D2.A
N$1  (via drill 0.35)
  Top 0.254: IC1.12 40.96,7.3 v40.64,7.62 | R3.1 46.77,6.06 v47.12,5.71
  Bottom 0.254: v47.12,5.71 42.54,5.71 v40.64,7.62
N$3
  Top 0.152: 21,5.84 Y1.P$2
  Top 0.254: U1.1 21,5.84 | Y1.P$2 20.15,6.27 C6.1
N$4
  Top 0.152: Y1.P$1 22.76,4.07
  Top 0.254: Y1.P$1 22.35,6.48 U1.2 | 22.76,4.07 C7.1
N$5
  Top 0.254: L1.2 24.91,3 C3.1 25.45,3.76 24.13,5.08 24.13,5.43 U1.6
N$6
  Top 0.152: U1.43 23.45,13.03 C4.1
N$7
  Top 0.254: IC1.3 36.72,8.51 39.75,8.51 39.94,6.67 IC1.11 42.15,6.73 42.3,6.73 | 42.3,6.73 43.31,6.73 43.56,6.98 C10.1 | IC1.10 42.3,6.24 42.3,6.73
N$8
  Top 0.152: R4.1 35,5.4
  Top 0.254: 35,5.4 IC1.8
N$9
  Top 0.254: C13.1 62.4,5.73 L5.2 60.96,6.97 TX/RX.17
N$10
  Top 0.254: C13.2 L2.1 65.39,4.64 C14.1
N$11
  Top 0.254: C14.2 66.62,5.64 L2.2 67.55,5.71 | 67.55,5.71 L3.1 | C15.1 67.56,5.73 67.55,5.71
N$12
  Top 0.254: L3.2 71.1,5.71 L4.1 70.61,4.46 C17.1
N$13
  Top 0.254: L4.2 73.91,5.33 74.93,5.08 J$1.SIG
N$14
  Top 0.152: IC1.9 42.15,5.33 42.93,5.33 43.32,5.73 R5.2
N$16
  Top 0.254: L6.2 67.94,10.43 67.94,9.78 67.44,9.27 C15.2 67.24,8.89 66.68,8.89 66.17,8.64 66.17,7.24 65.66,6.73 62.36,6.73 60.18,8.91 TX/RX.18
N$17
  Top 0.254: L9.1 63.36,9.2 C18.1 63.32,9.38 L7.2 61.71,9.27 61.21,9.27 61.07,9.41 TX/RX.19 59.55,9.38
N$18
  Top 0.254: L6.1 L8.2 64.59,10.47 C18.2
N$19
  Top 0.254: C19.1 66.09,11.56 63.63,11.56 63.36,11.29 L8.1 63.22,10.68 L7.1 61.96,10.29 61.34,10.29 60.96,9.91 TX/RX.20
N$20
  Top 0.254: TX/RX.24 59.54,11.91 61.34,13.72 61.34,15.24 61.47,15.37 62.03,15.37 C22.1
N$21
  Top 0.254: TX/RX.23 60.05,11.41 62.23,13.34 C22.2
N$22
  Top 0.254: TX/RX.21 60.57,10.41 61.21,11.05 62.48,11.05 62.48,11.68 62.87,12.06 63.43,12.06 C20.1
N$23
  Top 0.254: TX/RX.26 58.4,13.7 58.93,14.22 C24.2
N$24
  Top 0.254: TX/RX.14 57.9,4.6 R16.1
N$25
  Top 0.254: TX/RX.32 52.17,12.53 R14.1
N$26
  Top 0.254: TX/RX.29 56.9,13.71 56.13,14.48 55.24,14.48 54.74,14.73 54.74,15.29 C27.2
N$27
  Top 0.254: TX/RX.30 56.4,13.45 55.88,13.97 54.1,13.97 53.47,15.75 52.83,16.38 52.14,16.38 C29.2 50.43,16.45 Y3.3
N$28
  Top 0.254: TX/RX.31 55.9,13.19 55.75,13.34 47.55,13.34 Y3.1 45.27,14.47 C28.2
N$29
  Bottom 0.254: D2.C 30.5,16.64 30.76,16.38 R21.1
N$34
  Top 0.254: TX/RX.6 53.95,9.41 53.94,9.42 53.11,9.42 52.96,9.27 52.96,8.89 52.58,8.51 C32.2
N$38
  Top 0.254: L5.1 R15.1 62.16,3.19 C36.2
RAW  (via drill 0.35)
  Top 0.152: 8.76,11.85 U2.3 9.15,11.75 | 8.92,13.59 U2.1 | R18.2 11.75,9.14
  Top 0.254: 11.75,9.14 9.15,11.75 | U2.3 8.64,11.53 8.64,11.3
  Top 0.406: 8.76,11.85 C1.1 | 9.15,11.75 9.84,11.75 10.16,12.06 10.16,13.21 9.78,13.59 8.92,13.59
  Top 0.813: v7.75,9.14 8.64,10.03 8.64,11.3 | v6.98,9.14 v7.75,9.14 | v7.75,9.14 v7.75,8.38 v6.98,8.38
  Bottom 0.813: JP5.VCC 7.75,8.02 v7.75,8.38 | v6.98,8.38 6.98,7.37 | v6.98,8.38 v6.98,9.14 v7.75,9.14 v7.75,8.38 | v7.75,8.38 v6.98,8.38
SENSE_BAT
  Top 0.152: R18.1 R19.2
  Top 0.254: R18.1 14.79,9.14 15.99,10.47 17.87,10.47 18.39,9.95 U1.48
SPI1_MISO
  Top 0.254: U1.28 33.52,12.7 34.29,12.7 34.54,12.45 47.5,12.45 48.64,11.3 48.64,8.76 50.67,6.73 54.36,6.73 TX/RX.9
SPI1_MOSI  (via drill 0.35)
  Top 0.254: TX/RX.7 54.76,8.89 54.1,8.89 v53.72,8.76 | v34.42,10.41 33.74,9.95 U1.25
  Bottom 0.254: v53.72,8.76 53.34,8.89 48.26,8.89 46.86,10.41 v34.42,10.41
SPI1_SCK  (via drill 0.35)
  Top 0.254: U1.26 33.28,11.05 45.59,11.05 46.35,10.41 v46.35,7.62 | TX/RX.8 54.1,7.74 54.1,7.62 v53.98,7.62
  Bottom 0.254: v53.98,7.62 v46.35,7.62
SPI2_MISO  (via drill 0.35)
  Top 0.152: v31.24,3.81 v31.24,3.82
  Top 0.254: MEM.SO 13.97,3.3 v14.35,3.68 | v31.24,3.82 U1.16
  Bottom 0.254: v14.35,3.68 17.27,3.68 18.03,4.45 30.61,4.45 v31.24,3.81
SPI2_MOSI  (via drill 0.35)
  Top 0.152: 29.08,3.86 U1.13
  Top 0.254: MEM.SI 17.02,0.76 v19.18,2.92 | v29.08,2.92 29.08,3.86
  Bottom 0.254: v19.18,2.92 v29.08,2.92
SPI2_SCK  (via drill 0.35)
  Top 0.152: v30.48,3.17 v30.47,3.17
  Top 0.254: MEM.SCK 17.02,2.03 v18.67,3.68 | v30.47,3.17 U1.14
  Bottom 0.254: v18.67,3.68 29.97,3.68 v30.48,3.17
SS_MEM  (via drill 0.35)
  Top 0.152: v28.7,5.59 28.77,5.59 | 11.92,5.08 R2.1
  Top 0.254: MEM.!CS 10.92,4.57 v11.43,5.08 11.92,5.08 | 28.77,5.59 U1.15
  Bottom 0.254: v11.43,5.08 28.19,5.08 v28.7,5.59
SS_TX
  Top 0.254: U1.27 33.34,11.81 46.86,11.81 47.75,10.92 47.75,8.64 50.66,5.73 R20.1 53.12,5.73 53.23,5.84 55.12,5.84 56.4,7.12 TX/RX.11
SWCLK
  Top 0.254: U1.45 24.9,10.16 26.54,10.16 27.94,11.56 27.94,13.97 28.32,14.35 28.32,15.62 29.97,17.27 39.12,17.27 39.5,16.89 JP2.4
SWDIO  (via drill 0.35)
  Top 0.254: U1.46 24.51,9.84 v24.51,9.52
  Bottom 0.254: v24.51,9.52 24.51,10.79 28.07,14.35 29.46,14.35 29.84,13.97 42.16,13.97 42.29,14.1 42.29,15.62 41.53,16.38 JP2.2
USB+  (via drill 0.35)
  Top 0.254: C12.1 R4.2 34.93,4.08 34.81,4.19 v33.53,4.19
  Bottom 0.254: JP1.D+ 39.37,5.33 39.24,5.46 34.8,5.46 v33.53,4.19
USB-  (via drill 0.35)
  Top 0.152: R5.1 C16.1
  Top 0.254: C16.1 41.39,2.55 40.51,3.56 v38.61,3.56
  Bottom 0.254: JP1.D- 38.57,3.39 v38.61,3.56
USB_CTS  (via drill 0.35)
  Top 0.254: U1.24 31.7,9.02 v31.5,9.02 | v38.48,9.78 37.91,9.21 IC1.2
  Bottom 0.254: v31.5,9.02 32.26,9.78 v38.48,9.78
USB_RTS  (via drill 0.35)
  Top 0.254: U1.23 31.88,8.13 v30.61,8.13 | v39.12,6.6 39.05,6.67 IC1.6
  Bottom 0.254: v30.61,8.13 30.73,8.25 32.26,8.25 33.15,9.14 37.72,9.14 39.12,7.75 v39.12,6.6
USB_RX
  Top 0.254: U1.22 32.95,6.35 33.66,6.35 35.05,7.75 35.05,9.52 35.37,9.84 IC1.1
USB_TX
  Top 0.254: U1.21 32.88,5.71 33.91,5.71 36.13,7.94 IC1.4
USB_VCC  (via drill 0.35)
  Top 0.254: v36.83,1.78 41.91,1.78 v42.04,1.65 | v47.12,4.06 46.14,4.06 R3.2 45.85,3.44 C11.1
  Bottom 0.254: JP1.VBUS 36.87,1.82 v36.83,1.78 | v42.04,1.65 42.04,3.05 42.54,3.56 46.61,3.56 v47.12,4.06

### Text on the board
bNames: HA-GPSTrack